# Altium schematic sheet LED.SchDoc
size A3
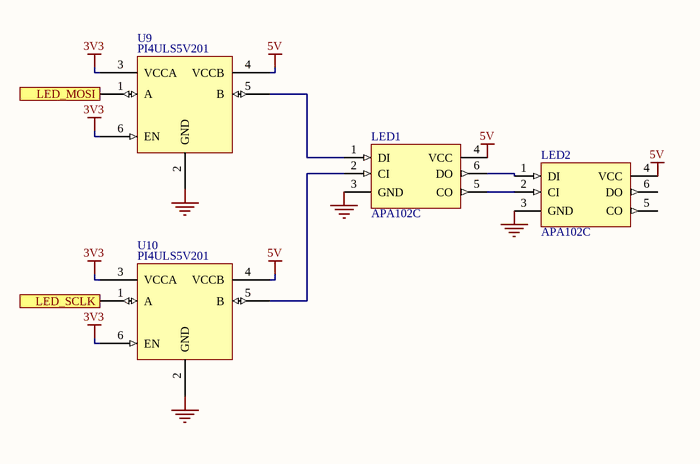
[diagram p0: LED.SchDoc]

## Parts
LED1  APA102C  [5x5_WS2812]
LED2  APA102C  [5x5_WS2812]
U9  PI4ULS5V201  [SOT23-PI4ULS5V201]
U10  PI4ULS5V201  [SOT23-PI4ULS5V201]

## Ports
LED_MOSI, LED_SCLK

## Nets
3V3: U9.3(VCCA) U9.6(EN) U10.3(VCCA) U10.6(EN)
5V: LED1.4(VCC) LED2.4(VCC) U9.4(VCCB) U10.4(VCCB)
GND: LED1.3(GND) LED2.3(GND) U9.2(GND) U10.2(GND)
LED_MOSI: U9.1(A) ; port LED_MOSI
LED_SCLK: U10.1(A) ; port LED_SCLK
NetLED1_1: LED1.1(DI) U9.5(B)
NetLED1_2: LED1.2(CI) U10.5(B)
NetLED1_5: LED1.5(CO) LED2.2(CI)
NetLED1_6: LED1.6(DO) LED2.1(DI)

Not connected (* = marked no-connect by the designer): LED2 5(CO) 6(DO)

## Library data of the parts
U9 U10 = PI4ULS5V201: Level Translator